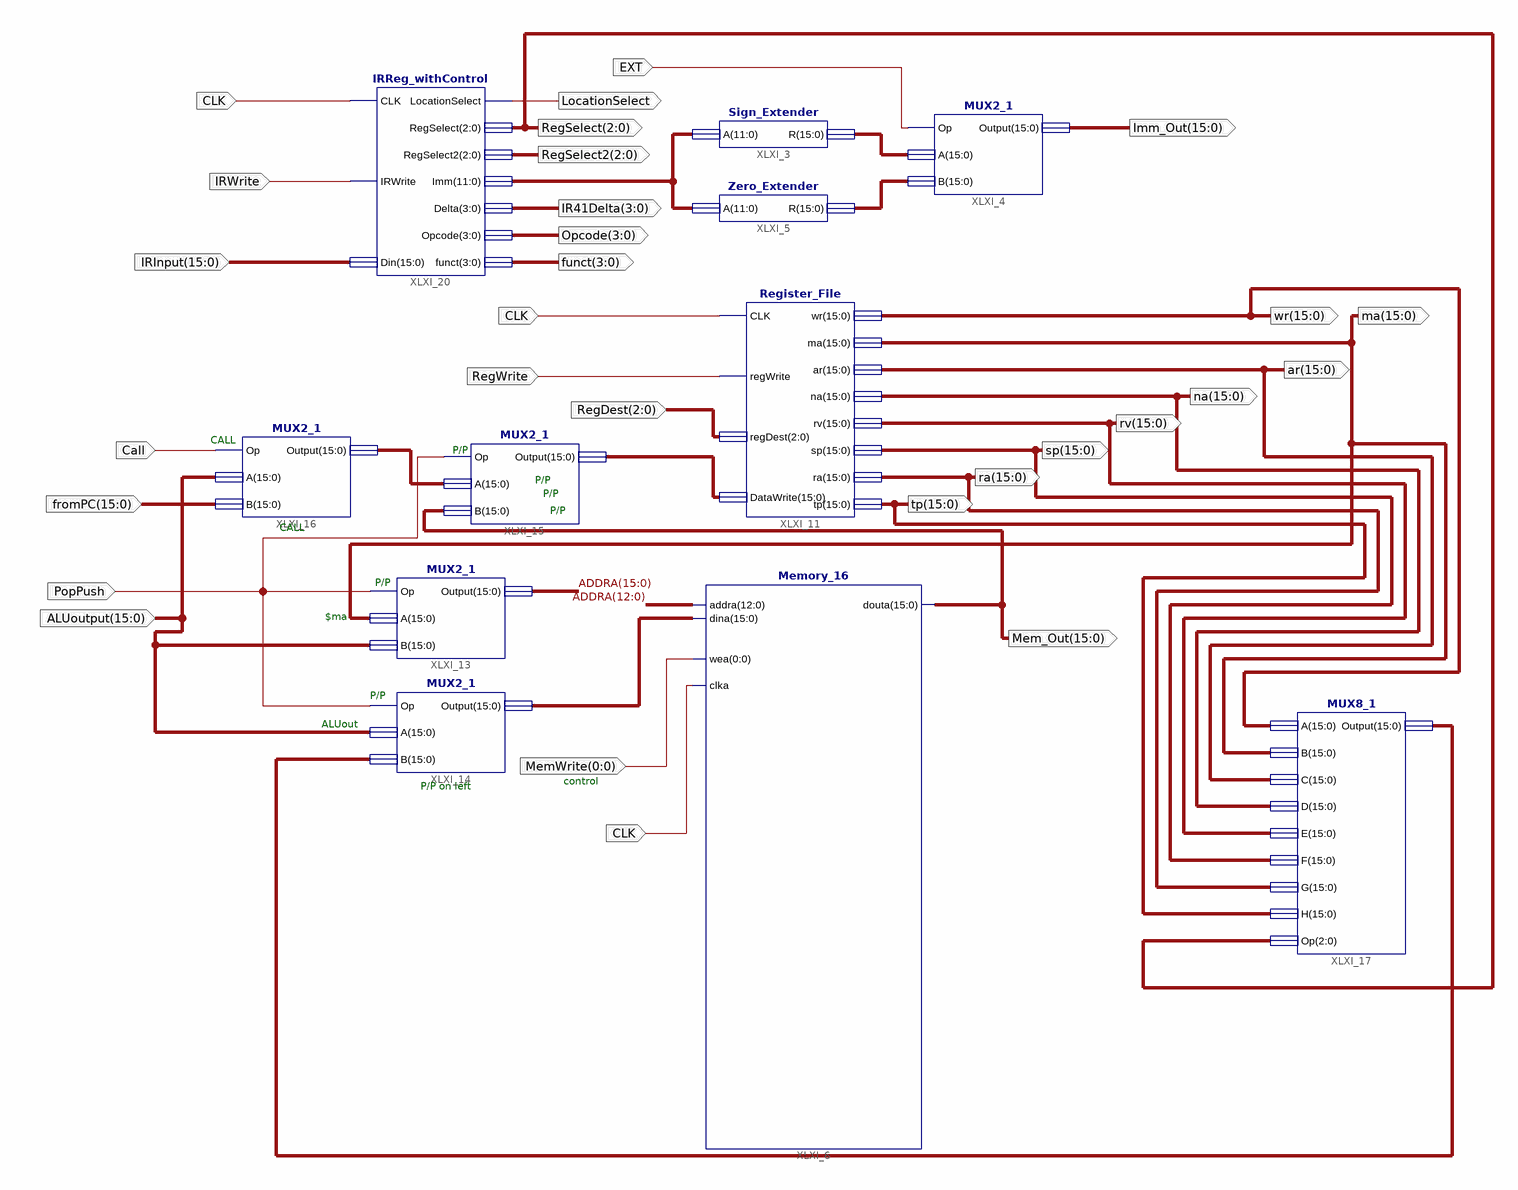
[diagram p0: schematic sheet 1]
// Xilinx ISE schematic PhaseTwo_Full.sch (spartan3e) as structural Verilog: 11 symbols, 27 ports
module PhaseTwo_Full (
  input  EXT,
  input  [0:0] MemWrite,
  input  CLK,
  input  RegWrite,
  input  [2:0] RegDest,
  input  [15:0] IRInput,
  input  [15:0] ALUoutput,
  input  PopPush,
  input  [15:0] fromPC,
  input  Call,
  input  IRWrite,
  output [15:0] Imm_Out,
  output [15:0] Mem_Out,
  output [15:0] sp,
  output [15:0] ra,
  output [15:0] tp,
  output [15:0] wr,
  output [15:0] ma,
  output [15:0] ar,
  output [15:0] na,
  output [15:0] rv,
  output LocationSelect,
  output [3:0] IR41Delta,
  output [2:0] RegSelect,
  output [2:0] RegSelect2,
  output [3:0] funct,
  output [3:0] Opcode
);

  wire [11:0] IR;
  wire [15:0] ADDRA, DataWriteMem, DataWriteReg, XLXN_27, XLXN_28, XLXN_77, XLXN_90;

  Zero_Extender XLXI_5 (.A(IR), .R(XLXN_28));
  Sign_Extender XLXI_3 (.A(IR), .R(XLXN_27));
  MUX2_1 XLXI_4 (.Op(EXT), .A(XLXN_27), .B(XLXN_28), .Output(Imm_Out));
  Memory_16 XLXI_6 (.addra(ADDRA[12:0]), .dina(DataWriteMem), .wea(MemWrite[0]), .clka(CLK), .douta(Mem_Out));
  Register_File XLXI_11 (
    .CLK(CLK), .regWrite(RegWrite), .regDest(RegDest), .DataWrite(DataWriteReg), .wr(wr), .ma(ma), .ar(ar),
    .na(na), .rv(rv), .sp(sp), .ra(ra), .tp(tp));
  MUX2_1 XLXI_13 (.Op(PopPush), .A(ma), .B(ALUoutput), .Output(ADDRA));
  MUX2_1 XLXI_14 (.Op(PopPush), .A(ALUoutput), .B(XLXN_77), .Output(DataWriteMem));
  MUX2_1 XLXI_15 (.Op(PopPush), .A(XLXN_90), .B(Mem_Out), .Output(DataWriteReg));
  MUX2_1 XLXI_16 (.Op(Call), .A(ALUoutput), .B(fromPC), .Output(XLXN_90));
  MUX8_1 XLXI_17 (.A(wr), .B(ma), .C(ar), .D(na), .E(rv), .F(sp), .G(ra), .H(tp), .Op(RegSelect), .Output(XLXN_77));
  IRReg_withControl XLXI_20 (
    .CLK(CLK), .IRWrite(IRWrite), .Din(IRInput), .LocationSelect(LocationSelect), .RegSelect(RegSelect),
    .RegSelect2(RegSelect2), .Imm(IR), .Delta(IR41Delta), .Opcode(Opcode), .funct(funct));

  // Notes on the sheet:
  //   CALL
  //   P/P
  //   P/P
  //   P/P
  //   P/P
  //   CALL
  //   P/P
  //   $ma
  //   P/P
  //   ALUout
  //   control
  //   P/P on left
endmodule
